# Altium schematic sheet Sheet2.SchDoc
size A4; SheetNumber: 4; SheetTotal: 5
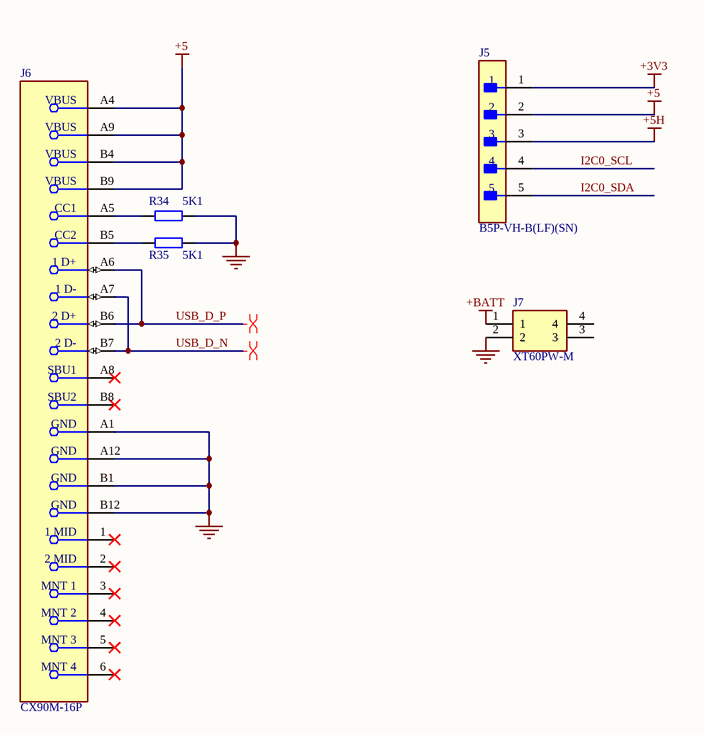
[diagram p0: Sheet2.SchDoc]

## Parts
J5  B5P-VH-B(LF)(SN)  [FP-B5P-VH-B_LF_SN-MFG]
J6  CX90M-16P  [FP-CX90M-16P-MFG]
J7  XT60PW-M  [XT60PWM]
R34  5K1  [RES_0402]
R35  5K1  [RES_0402]

## Nets
+3V3: J5.1
+5: J5.2 J6.A4(VBUS) J6.A9(VBUS) J6.B4(VBUS) J6.B9(VBUS)
+5H: J5.3
+BATT: J7.1
GND: J6.A1(GND) J6.A12(GND) J6.B1(GND) J6.B12(GND) J7.2 R34.2 R35.2
I2C0_SCL: J5.4
I2C0_SDA: J5.5
USB_D_N: J6.A7(1_D-) J6.B7(2_D-)
USB_D_P: J6.A6(1_D+) J6.B6(2_D+)
NetJ6_A5: J6.A5(CC1) R34.1
NetJ6_B5: J6.B5(CC2) R35.1

Not connected (* = marked no-connect by the designer): J6 1(1_MID)* 2(2_MID)* 3(MNT_1)* 4(MNT_2)* 5(MNT_3)* 6(MNT_4)* A8(SBU1)* B8(SBU2)*; J7 3 4

## Layout directives
differential pair: USB_D_N, USB_D_P

## Library data of the parts
J5 = CMP-17439-000483-1: CONN HEADER VERT 5POS 3.96MM; Contact Resistance: 20mR; Number of Positions: 5; Max Current Rating: 10A; Voltage Rating: 250V; Min Operating Temperature: -25°C; Fastening Type: Ramp; Max Operating Temperature: 85°C; Series: VH; Contact Finish - Mating: TIN; Depth: 8.5mm; Insulation Color: Natural; Length: 19.74mm; Number of Rows: 1; Flammability Rating: UL94 V-0; Orientation: Straight; Packaging: Bulk; Lead Free: Lead Free; Pitch: 3.96mm; Contact Material: Brass; Connector Type: Header; Housing Color: White; Contact Plating: Copper; Number of Pins: 5; Contact Shape: Square; Insulation Material: PBT; Max Voltage Rating (AC): 250V; Contact Type: Male Pin; Color: White; Termination: Solder
J6 = CMP-11601-000005-1: CONN RCPT USB2.0 TYPEC 16POS SMD; Connector Type: USB; Current Rating: 1.25A; Mating Cycles: 10000; Number of Contacts: 16; Gender: Receptacle; Shielding: Shielded; Number of Ports: 1; Insulation Color: Black; Termination: Solder; Min Operating Temperature: -30°C; Flammability Rating: UL94 V-0; Max Operating Temperature: 85°C; Packaging: Cut Tape; Contact Plating: Gold; Mount: Surface Mount
J7 = XT60PW-M: Connector; Manufacturer_Name: Changzou Amass Elec; Datasheet Link: https://www.tme.eu/Document/9b8d0c5eb7094295f3d3112c214d3ade/XT60PW%20SPEC.pdf; Height: 8.4mm; Manufacturer_Part_Number: XT60PW-M
R34 R35 = RES_0402: Resistor SMD 0402; Manufacturer: *; Manufacturer Part Number: *; Distributor Link: *; LCSC: *